# Altium schematic sheet 5_AUX.SchDoc
size A4; SheetNumber: 5; SheetTotal: 5
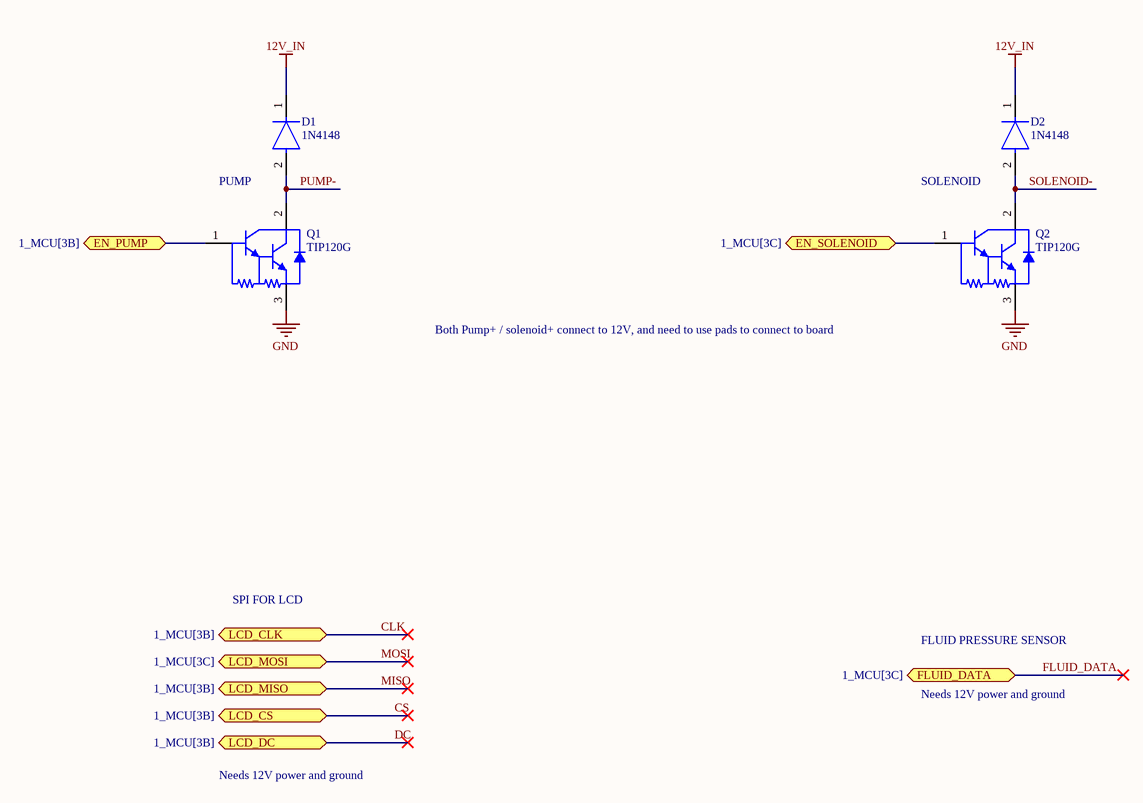
[diagram p0: 5_AUX.SchDoc]

## Parts
D1  1N4148  [FP-017AG-MFG]
D2  1N4148  [FP-017AG-MFG]
Q1  TIP120G  [ONSC-TO-220-3-221A-09]
Q2  TIP120G  [ONSC-TO-220-3-221A-09]

## Ports
EN_PUMP (bidir, see 1_MCU[3B]), EN_SOLENOID (bidir, see 1_MCU[3C]), FLUID_DATA (bidir, see 1_MCU[3C]), LCD_CLK (bidir, see 1_MCU[3B]), LCD_CS (bidir, see 1_MCU[3B]), LCD_DC (bidir, see 1_MCU[3B]), LCD_MISO (bidir, see 1_MCU[3B]), LCD_MOSI (bidir, see 1_MCU[3C])

## Nets
12V_IN: D1.1(C) D2.1(C)
GND: Q1.3(E) Q2.3(E)
CLK: port LCD_CLK
CS: port LCD_CS
DC: port LCD_DC
EN_PUMP: Q1.1(B) ; port EN_PUMP
EN_SOLENOID: Q2.1(B) ; port EN_SOLENOID
FLUID_DATA: port FLUID_DATA
MISO: port LCD_MISO
MOSI: port LCD_MOSI
PUMP-: D1.2(A) Q1.2(C)
SOLENOID-: D2.2(A) Q2.2(C)

## Notes on the sheet
- PUMP
- SOLENOID
- Both Pump+ / solenoid+ connect to 12V, and need to use pads to connect to board
- SPI FOR LCD
- FLUID PRESSURE SENSOR
- Needs 12V power and ground

## Library data of the parts
D1 D2 = CMP-07163-000046-1: DIODE GEN PURP 100V 200MA DO35; Forward Voltage: 1V; Max Power Dissipation: 500mW; Max Reverse Current: 5uA; Forward Current: 300mA; Current: 4A; Reverse Recovery Time: 4ns; Element Configuration: Single; Outside Diameter: 1.85mm; Capacitance: 4pF; Polarity: Standard; Max Forward Surge Current (Ifsm): 1A; Reverse Voltage: 100V; Output Current: 200mA; Average Rectified Current: 200mA; Diameter: 1.91mm; Max Repetitive Reverse Voltage (Vrrm): 100V; Current Rating: 200mA; Case/Package: DO-35; Lead Free: Lead Free; Number of Pins: 2; Recovery Time: 4ns; Packaging: Bulk; Contact Plating: Tin; Voltage: 100V; Mount: Through Hole; Max Surge Current: 4A; Package Quantity: 2000; Width: 1.91mm; Max Reverse Voltage (DC): 100V; Length: 4.56mm; Radiation Hardening: No; Power Dissipation: 500mW; Voltage Rating (DC): 100V; Peak Non-Repetitive Surge Current: 4A; REACH SVHC: No SVHC; Height: 4.56mm; Max Operating Temperature: 175°C; Series: -; Weight: 0.01lb; Min Operating Temperature: -65°C
Q1 Q2 = CMP-1047-00134-1: Plastic Medium-Power, Complementary Silicon Transistor, 3-Pin TO-220, Pb-Free, Tube; Manufacturer: On Semiconductor; Polarity: NPN; IC Continuous (A): 5; PackageDescription: 3-Pin Flange Mount, Vertical Straight Lead, Body 9.97 x 4.445 mm, Pitch 2.54 mm; PackageVersion: Rev. AG, 09/2011; ComponentLink2Description: Datasheet; DatasheetVersion: Rev. 8; Mounting Technology: Through Hole; ComponentLink1URL: http://www.onsemi.com/; RoHS: TRUE; ComponentLink3URL: http://www.onsemi.com/pub_link/Collateral/221A-09.PDF; ComponentLink3Description: Package Specification; ComponentLink1Description: Manufacturer URL; Packing: Tube; PackageReference: TO-220-3-221A-09; ComponentLink2URL: http://www.onsemi.cn/pub_link/Collateral/TIP120-D.PDF; PartNumber: TIP120G